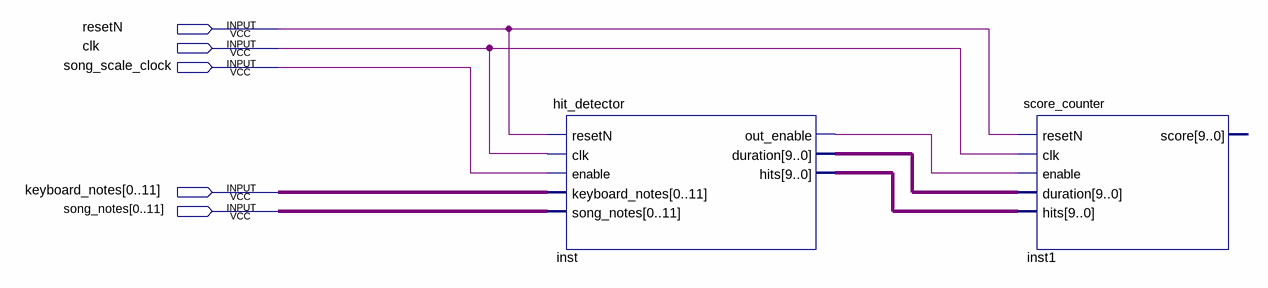
[diagram p0: schematic sheet]
// Quartus schematic score_manager.bdf as structural Verilog: 2 symbols, 5 pins
module score_manager (
  input  resetN,
  input  clk,
  input  song_scale_clock,
  input  [0:11] keyboard_notes,
  input  [0:11] song_notes
);

  wire inst_out_enable;
  wire [9:0] inst_duration, inst_hits;

  hit_detector inst (
    .resetN(resetN), .clk(clk), .enable(song_scale_clock), .keyboard_notes(keyboard_notes),
    .song_notes(song_notes), .out_enable(inst_out_enable), .duration(inst_duration), .hits(inst_hits));
  score_counter inst1 (
    .resetN(resetN), .clk(clk), .enable(inst_out_enable), .duration(inst_duration), .hits(inst_hits));  // open: score
endmodule
